# EAGLE design xlr_headphone_amp (EAGLE 6.3)
AUTOR: Max S.; VERSION: v3.0

## Sheet 1 of 2
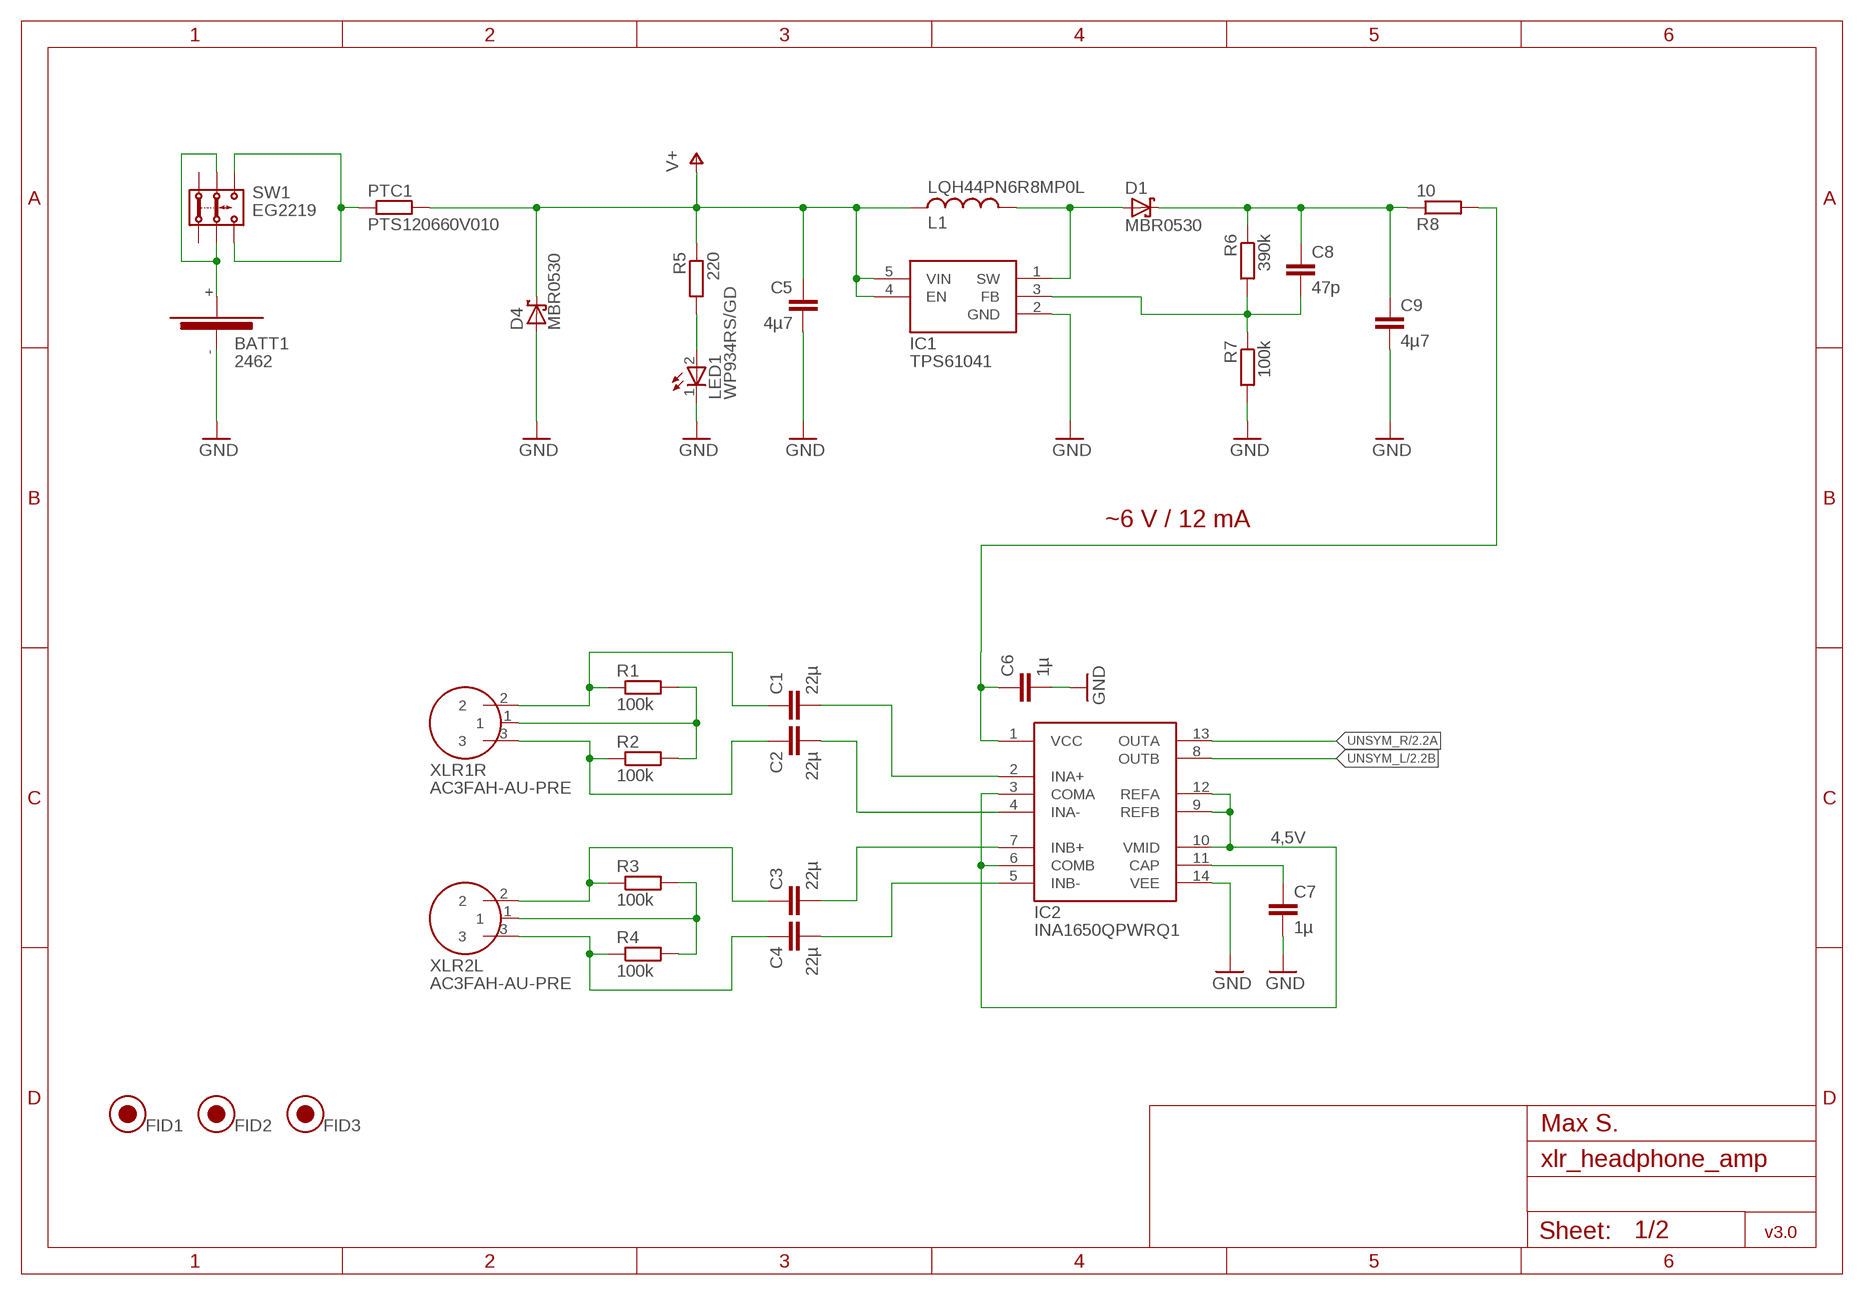
[diagram p0: schematic, sheet 1]

### Parts
BATT1  2462  BATT_HOLDERBATT  [2462]
C1  22µ  C_EU1206  [C1206]
C2  22µ  C_EU1206  [C1206]
C3  22µ  C_EU1206  [C1206]
C4  22µ  C_EU1206  [C1206]
C5  4µ7  C_EU1206  [C1206]
C6  1µ  C_EU1206  [C1206]
C7  1µ  C_EU1206  [C1206]
C8  47p  C_EU1206  [C1206]
C9  4µ7  C_EU1206  [C1206]
D1  MBR0530  SCHOTTKY-DIODESOD123  [SOD123]
D4  MBR0530  SCHOTTKY-DIODESOD123  [SOD123]
FID1  FIDICUAL  [FIDICUAL]
FID2  FIDICUAL  [FIDICUAL]
FID3  FIDICUAL  [FIDICUAL]
IC1  TPS61041  TPS6104X  [SOT23-5]
IC2  INA1650QPWRQ1  INA1650INA1650  [R-PDSO-G14]
L1  LQH44PN6R8MP0L  LL1515  [L1515(4040)]
LED1  WP934RS/GD  [WP934]
PTC1  PTS120660V010  R_EUR1206  [R1206]
R1  100k  R_EUR1206  [R1206]
R2  100k  R_EUR1206  [R1206]
R3  100k  R_EUR1206  [R1206]
R4  100k  R_EUR1206  [R1206]
R5  220  R_EUR1206  [R1206]
R6  390k  R_EUR1206  [R1206]
R7  100k  R_EUR1206  [R1206]
R8  10  R_EUR1206  [R1206]
SW1  EG2219  SW_2P2T  [EG2219]
XLR1R  AC3FAH-AU-PRE  XLR_CONNECTORFEMALE  [AC3FAH]
XLR2L  AC3FAH-AU-PRE  XLR_CONNECTORFEMALE  [AC3FAH]

### Nets
4,5V: IC2.3(COMA) IC2.6(COMB) IC2.9(REFB) IC2.10(VMID) IC2.12(REFA)
GND: BATT1.-(NEG) C5.2 C6.2 C7.2 C9.2 D4.A IC1.2(GND) IC2.14(VEE) LED1.1(C) R7.2 ; also sheet 2
N$1: R1.2 R2.2 XLR1R.1
N$2: C1.1 R1.1 XLR1R.2
N$3: C2.1 R2.1 XLR1R.3
N$4: C1.2 IC2.2(INA+)
N$5: C2.2 IC2.4(INA-)
N$6: R3.2 R4.2 XLR2L.1
N$7: C3.1 R3.1 XLR2L.2
N$8: C4.1 R4.1 XLR2L.3
N$9: C3.2 IC2.7(INB+)
N$10: C4.2 IC2.5(INB-)
N$11: C7.1 IC2.11(CAP)
N$25: LED1.2(A) R5.2
N$26: D1.A IC1.1(SW) L1.1
N$27: C8.2 IC1.3(FB) R6.2 R7.1
N$29: C8.1 C9.1 D1.C R6.1 R8.1
N$30: BATT1.+(POS) SW1.B1 SW1.B2
N$31: PTC1.1 SW1.C1 SW1.C2
N$32: C6.1 IC2.1(VCC) R8.2
UNSYM_L: IC2.8(OUTB) ; also sheet 2
UNSYM_R: IC2.13(OUTA) ; also sheet 2
V+: C5.1 D4.C IC1.4(EN) IC1.5(VIN) L1.2 PTC1.2 R5.1 ; also sheet 2
Unconnected: SW1.A1 SW1.A2

### Notes on the sheet
- ~6 V / 12 mA

## Sheet 2 of 2
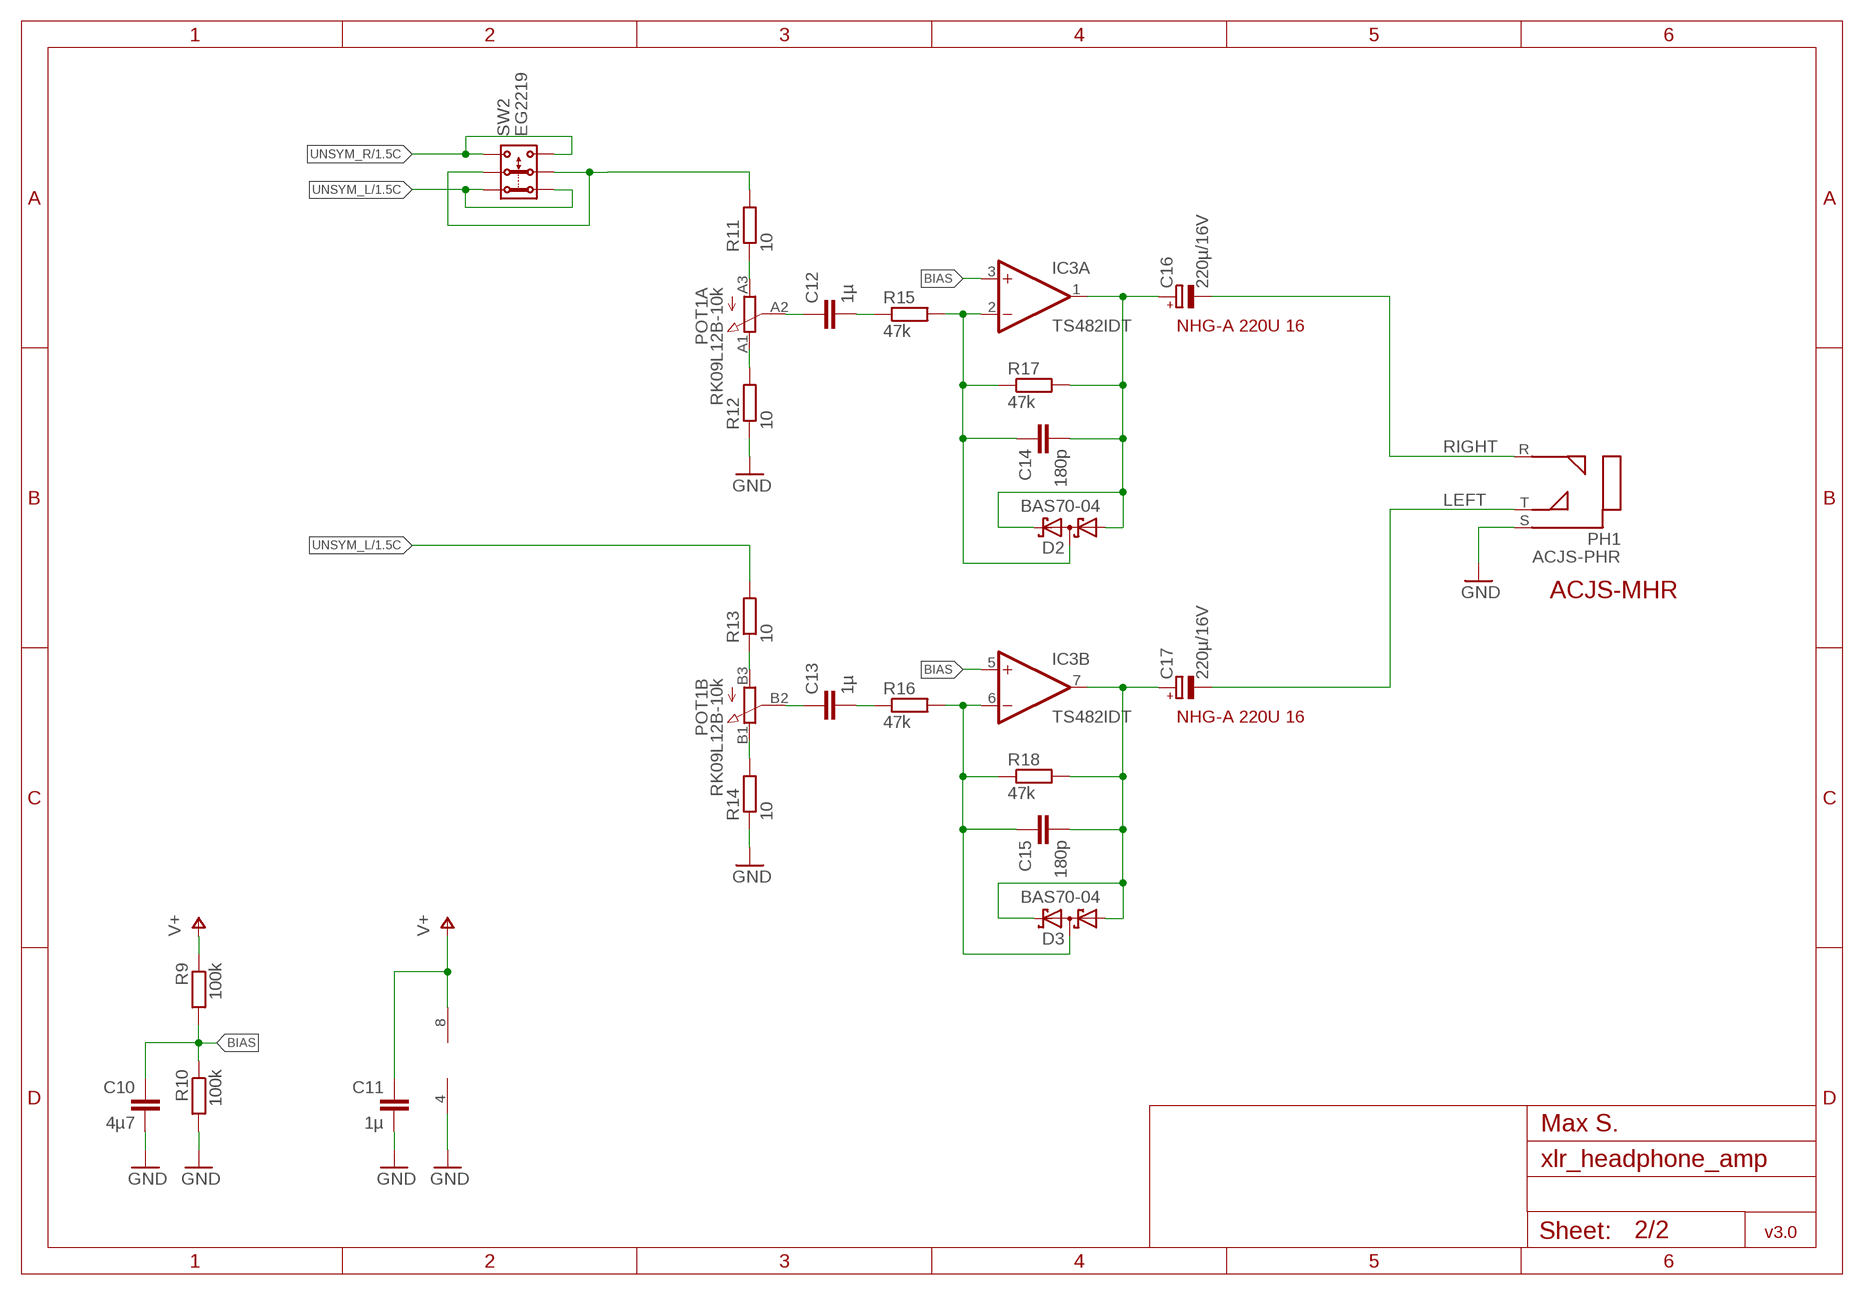
[diagram p1: schematic, sheet 2]

### Parts
C10  4µ7  C_EU1206  [C1206]
C11  1µ  C_EU1206  [C1206]
C12  1µ  C_EU1206  [C1206]
C13  1µ  C_EU1206  [C1206]
C14  180p  C_EU1206  [C1206]
C15  180p  C_EU1206  [C1206]
C16  220µ/16V  CPOL-EUE2.5-6  [E2,5-6]
C17  220µ/16V  CPOL-EUE2.5-6  [E2,5-6]
D2  BAS70-04  [SOT23]
D3  BAS70-04  [SOT23]
IC3  TS482IDT  LM358D  [SO08]
PH1  ACJS-PHR  1/4"_JACK-MH  [ACJS]
POT1  RK09L12B-10k  AUDIO_POTRK09L12  [RK09L12]
R9  100k  R_EUR1206  [R1206]
R10  100k  R_EUR1206  [R1206]
R11  10  R_EUR1206  [R1206]
R12  10  R_EUR1206  [R1206]
R13  10  R_EUR1206  [R1206]
R14  10  R_EUR1206  [R1206]
R15  47k  R_EUR1206  [R1206]
R16  47k  R_EUR1206  [R1206]
R17  47k  R_EUR1206  [R1206]
R18  47k  R_EUR1206  [R1206]
SW2  EG2219  SW_2P2T  [EG2219]

### Nets
BIAS: C10.1 IC3.3(A:+IN) IC3.5(B:+IN) R9.2 R10.1
GND: C10.2 C11.2 IC3.4(P:V-) PH1.S R10.2 R12.1 R14.1 ; also sheet 1
LEFT: C17.- PH1.T
N$12: POT1.B1 R14.2
N$13: POT1.B3 R13.1
N$14: C14.1 D2.3(C1A2) IC3.2(A:-IN) R15.2 R17.1
N$15: R11.2 SW2.B1 SW2.B2
N$16: C13.1 POT1.B2
N$17: POT1.A1 R12.2
N$18: C12.2 R15.1
N$19: C12.1 POT1.A2
N$20: C15.1 D3.3(C1A2) IC3.6(B:-IN) R16.2 R18.1
N$21: C15.2 C17.+ D3.1(A1) D3.2(C2) IC3.7(B:OUT) R18.2
N$22: POT1.A3 R11.1
N$23: C13.2 R16.1
N$24: C14.2 C16.+ D2.1(A1) D2.2(C2) IC3.1(A:OUT) R17.2
RIGHT: C16.- PH1.R
UNSYM_L: R13.2 SW2.A1 SW2.A2 ; also sheet 1
UNSYM_R: SW2.C1 SW2.C2 ; also sheet 1
V+: C11.1 IC3.8(P:V+) R9.1 ; also sheet 1

### Notes on the sheet
- NHG-A 220U 16
- ACJS-MHR
- NHG-A 220U 16

## Library data of the parts
BATT1 = xlr_headphoneamp:BATT_HOLDER
C1-C15 = NWA_Projekt:C_EU
C16 C17 = rcl:CPOL-EU: POLARIZED CAPACITOR, European symbol
D1 D4 = diode:SCHOTTKY-DIODE: Schottky Diode
D2 D3 = diode:BAS70-04: Silicon Schottky Diodes General-purpose diode for high-speed switching
FID1-FID3 = xlr_headphoneamp:FIDICUAL
IC1 = xlr_headphoneamp:TPS6104X
IC2 = xlr_headphoneamp:INA1650
IC3 = linear:LM358: OP AMP also LM158; LM258; LM2904 Source: http://cache.national.com/ds/LM/LM158.pdf
L1 = xlr_headphoneamp:L
LED1 = xlr_headphoneamp:WP934
PH1 = xlr_headphoneamp:1/4"_JACK
POT1 = xlr_headphoneamp:AUDIO_POT
PTC1 R1-R18 = NWA_Projekt:R_EU
SW1 SW2 = xlr_headphoneamp:SW_2P2T
XLR1R XLR2L = xlr_headphoneamp:XLR_CONNECTOR

## Board
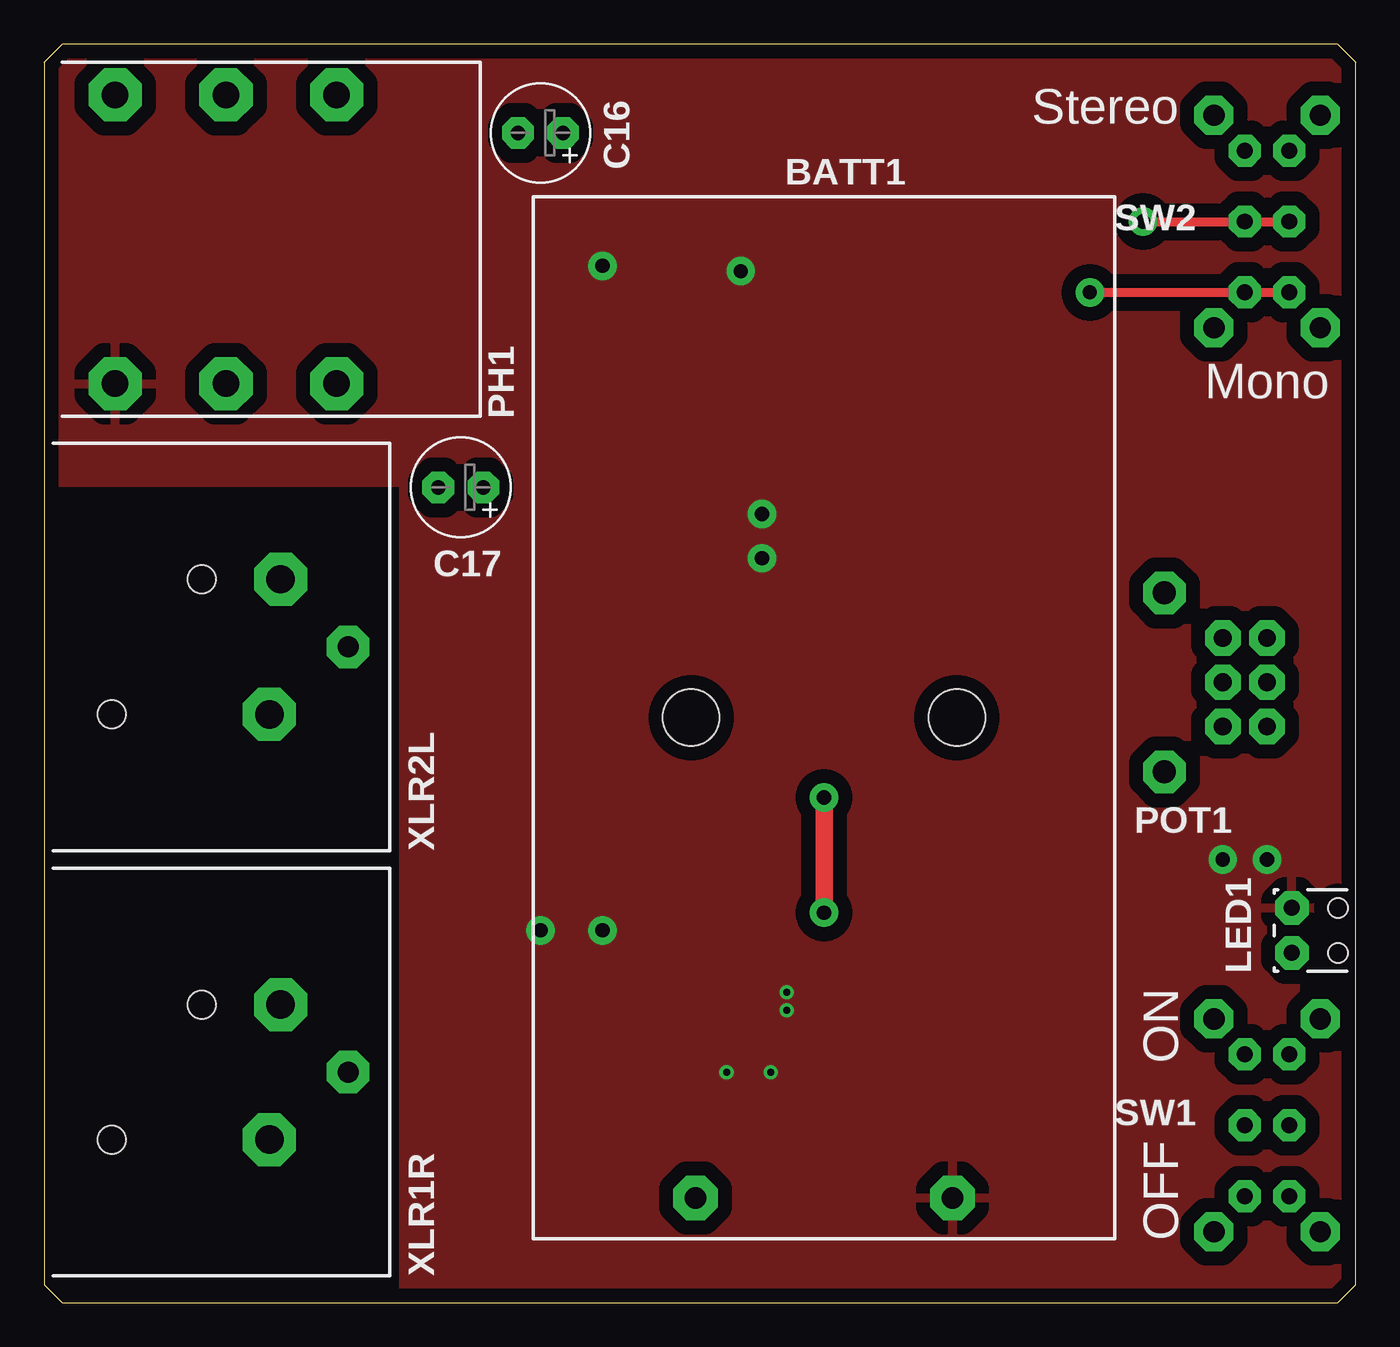
[diagram p2: board, top side]
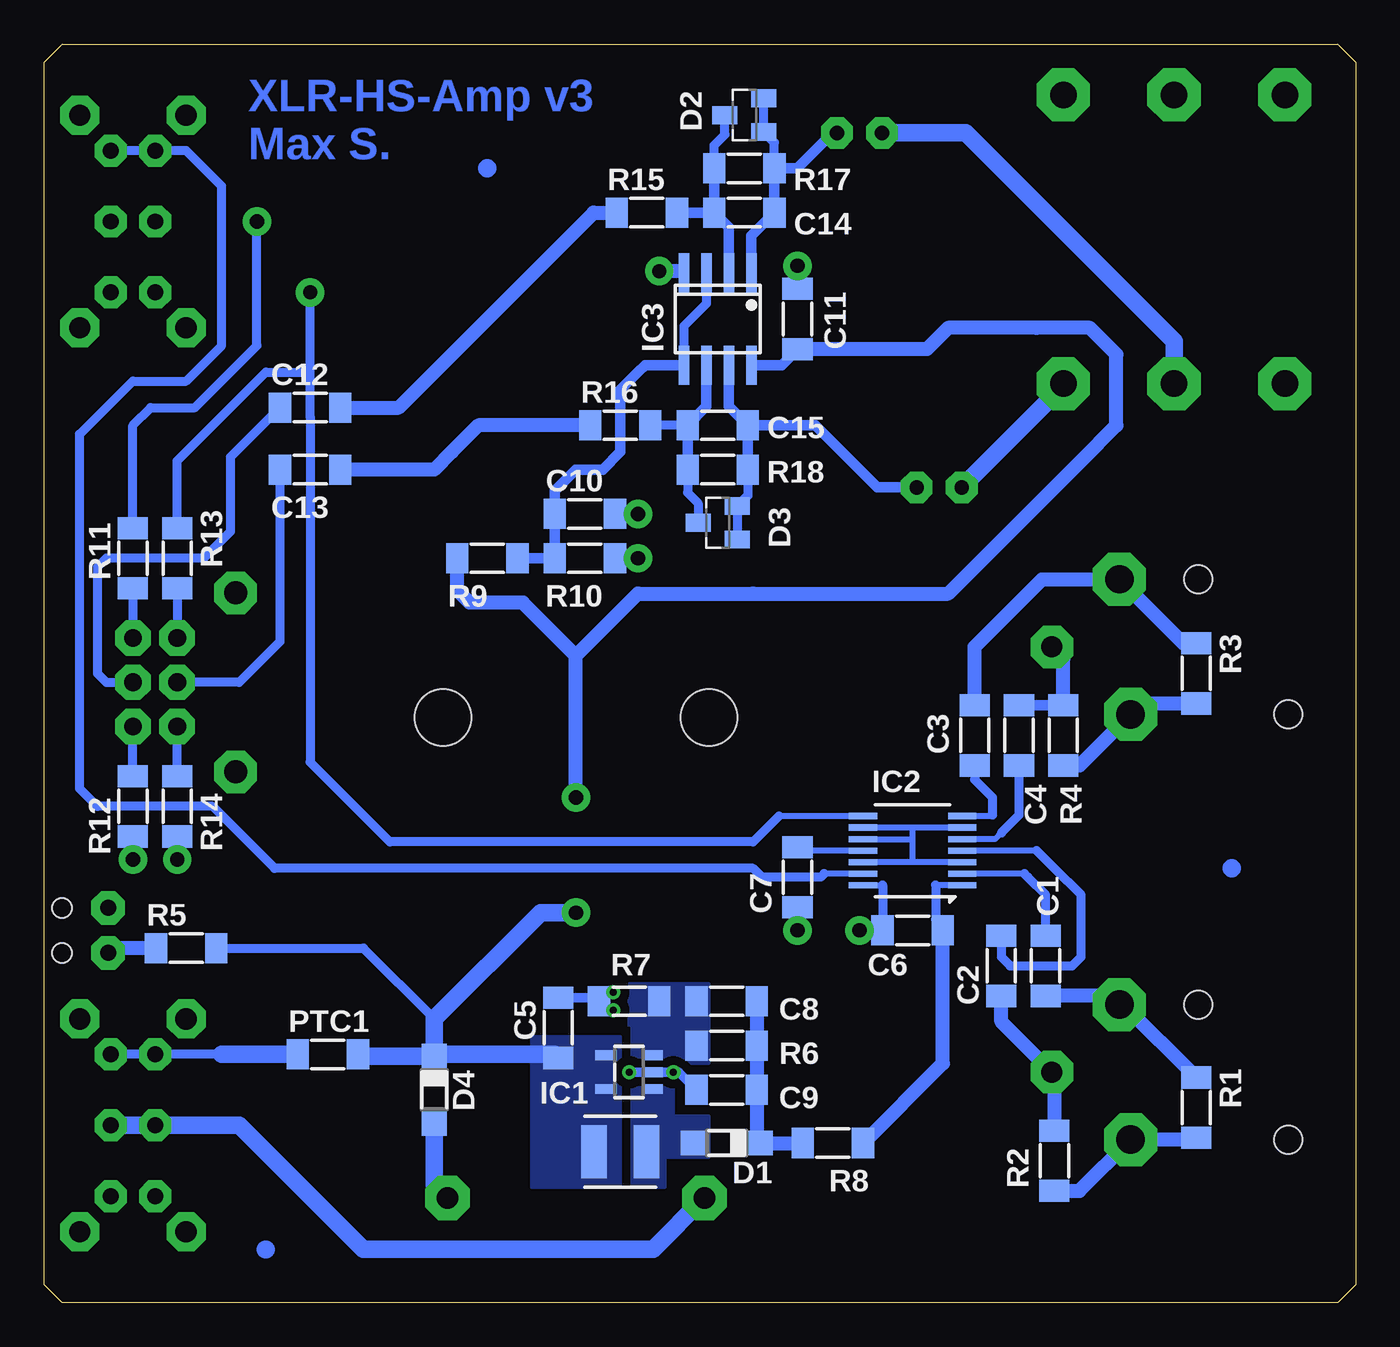
[diagram p3: board, bottom side, seen from below]

Size 74 x 71 mm. Coordinates in mm from the lower left corner, seen from the top.
Outline: 1,0 73,0 74,1 74,70 73,71 1,71 0,70 0,1 1,0
Copper layers (1*16): Top 0.018mm / dielectric 0.138mm / Bottom 0.018mm
Design rules "Aisler_4layer_DRC *": minimum track width 6mil, minimum drill 0.2mm, track to track 6mil, track to pad 6mil, pad to pad 6mil, via to via 6mil, smd to smd 0mil, copper to edge 0.4mm, drill to drill 10mil, minimum pad ring 10mil, minimum via ring 0.15mm, stop-mask expansion 2mil, vias tented up to drill 100mil, thermal gap 0.8mm
bRestrict: area 30.5,27 to 42.5,39; area 45.5,27 to 57.5,39

### Footprints (pad centres in the part's own frame; a part is rotated, then mirrored left to right if it is on the bottom)
2462 = drill 1.2 pad 2.5 octagon: + 27.1,-7.25; - 27.1,7.25 | hole 3.2: 0,-7.5; 0,7.5
C1206 = smd 1.25 x 1.7: 1 -1.7,0; 2 1.7,0
E2,5-6 = drill 0.813 pad 1.778 octagon: + -1.27,0; - 1.27,0
SOD123 = smd 1.4 x 1.4: A 1.9,0; C -1.9,0
SOT23 = smd 1 x 1.4: 1 -0.95,-1.1; 2 0.95,-1.1; 3 0,1.1
SOT23-5 = smd 0.55 x 1.2: 1 -0.95,-1.3; 2 0,-1.3; 3 0.95,-1.3; 4 0.95,1.3; 5 -0.95,1.3
R-PDSO-G14 = smd 0.35 x 1.6: 1 -1.95,-2.8; 2 -1.3,-2.8; 3 -0.65,-2.8; 4 0,-2.8; 5 0.65,-2.8; 6 1.3,-2.8; 7 1.95,-2.8; 8 1.95,2.8; 9 1.3,2.8; 10 0.65,2.8; 11 0,2.8; 12 -0.65,2.8; 13 -1.3,2.8; 14 -1.95,2.8
SO08 = smd 0.6 x 2.2: 1 -1.905,-2.6; 2 -0.635,-2.6; 3 0.635,-2.6; 4 1.905,-2.6; 5 1.905,2.6; 6 0.635,2.6; 7 -0.635,2.6; 8 -1.905,2.6
L1515(4040) = smd 1.45 x 3: 1 -1.475,0; 2 1.475,0
WP934 = drill 0.9 pad 1.9 octagon: 1 3.6,-1.27; 2 3.6,1.27 | hole 1.1: 1,-1.27; 1,1.27
ACJS = drill 1.5 pad 3 octagon: R -8.15,-10.25; RN 8.15,-10.25; S -8.15,-4; SN 8.15,-4; T -8.15,-16.5; TN 8.15,-16.5
RK09L12 = drill 1 pad 2 octagon: A1 -5,-2.5; A2 -5,0; A3 -5,2.5; B1 -7.5,-2.5; B2 -7.5,0; B3 -7.5,2.5 | drill 1.3 pad 2.4 octagon: M1 -10.8,5.05; M2 -10.8,-5.05
R1206 = smd 1.25 x 1.7: 1 -1.7,0; 2 1.7,0
EG2219 = drill 0.9 pad 1.8 octagon: A1 -4,1.25; A2 -4,-1.25; B1 0,1.25; B2 0,-1.25; C1 4,1.25; C2 4,-1.25 | drill 1.2 pad 2.2 octagon: X1 -6,-3; X2 -6,3; X3 6,3; X4 6,-3
AC3FAH = drill 1.6 pad 3 octagon: 1 -3.81,-12.7; 2 3.81,-13.335 | drill 1.2 pad 2.4 octagon: 3 0,-17.145 | hole 1.6: -3.81,-3.81; 3.81,-8.89

### Placement (x,y rotation side)
BATT1  44,33 270 top
C1  17.5,19 90 bottom
C2  20,19 90 bottom
C3  21.5,32 270 bottom
C4  19,32 270 bottom
C5  45,15.5 90 bottom
C6  25,21 180 bottom
C7  31.5,24 270 bottom
C8  35.5,17 180 bottom
C9  35.5,12 180 bottom
C10  43.5,44.5 0 bottom
C11  31.5,55.5 90 bottom
C12  59,50.5 0 bottom
C13  59,47 0 bottom
C14  34.5,61.5 0 bottom
C15  36,49.5 0 bottom
C16  28,66 180 top
C17  23.5,46 180 top
D1  35.5,9 180 bottom
D2  34.5,67 90 bottom
D3  36,44 90 bottom
D4  52,12 270 bottom
FID1  7,24.5 0 bottom
FID2  61.5,3 0 bottom
FID3  49,64 0 bottom
IC1  41,13 90 bottom
IC2  25,25.5 90 bottom
IC3  36,55.5 180 bottom
L1  41.5,8.5 180 bottom
LED1  74,21 180 top
PH1  0,60 90 top
POT1  74,35 0 top
PTC1  58,14 0 bottom
R1  9,11 270 bottom
R2  17,8 270 bottom
R3  9,35.5 270 bottom
R4  16.5,32 270 bottom
R5  66,20 180 bottom
R6  35.5,14.5 180 bottom
R7  41,17 180 bottom
R8  29.5,9 0 bottom
R9  49,42 0 bottom
R10  43.5,42 0 bottom
R11  69,42 90 bottom
R12  69,28 90 bottom
R13  66.5,42 90 bottom
R14  66.5,28 90 bottom
R15  40,61.5 0 bottom
R16  41.5,49.5 0 bottom
R17  34.5,64 0 bottom
R18  36,47 0 bottom
SW1  69,10 90 top
SW2  69,61 90 top
XLR1R  0,13 90 top
XLR2L  0,37 90 top

### Tracks (layer width: path | path; a pad name or v marks a point on that pad's centre or on a via)
4,5V
  Bottom 0.35: IC2.6 25,26.8 | 25,26.8 IC2.9 | IC2.3 24.98,24.85 | 24.98,24.85 IC2.12 | 24.98,24.85 25,24.87 25,26.5 | 25,26.5 25,26.8 | IC2.10 25,26.15 25,26.5
BIAS
  Bottom 0.35: 47,42 R9.2
  Bottom 0.5: IC3.3 36.63,56.37 37.5,55.5 37.91,55.09 IC3.5
  Bottom 0.6: 47,42 R10.1 C10.1 45.2,45.8 44,47 42.5,47 41.5,48 41.5,51.5 40.5,52.5 40.1,52.9 IC3.5
GND  (via drill 0.4 pad 0.8, 0.8 pad 1.6)
  Bottom 0.35: IC2.14 26.7,23.55 | IC3.4 38.01,58.2
  Bottom 0.5: 26.7,23.55 C6.2
  Bottom 0.55: C9.2 38.2,13 IC1.2 v41,13 | R7.2 42.7,17.2 | 42.7,17.2 C5.2 | 42.7,17.2 42.5,17.4 | C11.2 v31.5,58.5
  Bottom 0.6: R14.1 66.5,26.1 | R12.1 69,26 | 42.5,17.4 42.5,17.5 v41.9,17.5 | R7.2 42.7,16.5 v41.9,16.5
  Bottom 0.8: 38.01,58.2 v39.3,58.2
  Bottom 1: C10.2 v40.5,44.5 | R10.2 v40.5,42 | C6.2 v28,21 | C7.2 v31.5,21 | 66.5,26.1 v66.5,25 | 69,26 v69,25 | BATT1.- 52,6.65 D4.A
  other vias: 38.5,13
  pour Top (isolate 0.8): 0,71 74,71 74,0 0,0
LEFT
  Bottom 1: PH1.T 16.5,51.73 C17.-
N$1
  Bottom 0.35: R1.2 9.11,9.19
  Bottom 0.8: 9.11,9.19 XLR1R.1 15.59,6.3 R2.2
N$2
  Bottom 0.6: XLR1R.2 13.11,16.81
  Bottom 0.8: 13.11,16.81 R1.1 | XLR1R.2 13.82,17.3 C1.1
N$3
  Bottom 0.35: XLR1R.3 17,12.86
  Bottom 0.8: XLR1R.3 20,15.86 C2.1 | 17,12.86 R2.1
N$4
  Bottom 0.35: 18.7,24.2 IC2.2
  Bottom 0.5: C1.2 17.5,23 18.5,24 18.7,24.2
N$5
  Bottom 0.35: 18,25.5 IC2.4
  Bottom 0.5: C2.2 20,19.5 19.5,19 16,19 15.5,19.5 15.5,23 17,24.5 18,25.5
N$6
  Bottom 0.6: 15.59,30.3 R4.2
  Bottom 0.8: R3.2 12.09,33.8 XLR2L.1 15.59,30.3
N$7
  Bottom 0.35: R3.1 9.72,37.2
  Bottom 0.8: 9.72,37.2 XLR2L.2 17.69,40.81 18,40.5 21.5,37 C3.1
N$8
  Bottom 0.6: R4.1 C4.1
  Bottom 0.8: R4.1 16.5,36.35 XLR2L.3
N$9
  Bottom 0.35: 20.5,27.5 20.55,27.45 IC2.7
  Bottom 0.5: C3.2 21.5,29.5 21,29 20.5,28.5 20.5,28 20.5,27.5
N$10
  Bottom 0.35: 20,26.5 20.35,26.15 IC2.5
  Bottom 0.5: C4.2 19,27.5 20,26.5
N$11
  Bottom 0.35: IC2.11 31.5,25.5 C7.1
N$12
  Bottom 0.5: R14.2 POT1.B1
N$13
  Bottom 0.5: R13.1 POT1.B3
N$14
  Bottom 0.5: R17.1 36.2,65.3 36,65.5 35.6,65.9 D2.3
  Bottom 0.6: IC3.2 35.37,60.66 C14.1 | C14.1 R15.2 | C14.1 R17.1
N$15  (via drill 0.8 pad 1.6)
  Top 0.5: v62,61 SW2.B1 SW2.B2
  Bottom 0.5: R11.2 69,49.5 68,50.5 65.5,50.5 62,54 v62,61
N$16
  Bottom 0.5: C13.1 60.7,37.3 63,35 POT1.B2
N$17
  Bottom 0.5: R12.2 POT1.A1
N$18
  Bottom 0.8: C12.2 54,50.5 47,57.5 43,61.5 R15.1
N$19
  Bottom 0.5: C12.1 63.5,47.7 63.5,44 63.5,43.5 65,42 70.5,42 71,41.5 71,35.5 70.5,35 POT1.A2
N$20
  Bottom 0.5: C15.1 R16.2 | R18.1 37.7,45.7 37.5,45.5 37.1,45.1 D3.3
  Bottom 0.6: IC3.6 36.63,50.56 C15.1 R18.1
N$21
  Bottom 0.5: R18.2 34.3,45.55 D3.2 D3.1
  Bottom 0.6: IC3.7 35.37,50.56 C15.2 | C15.2 R18.2 | C17.+ 27,46 30.5,49.5 C15.2
N$22
  Bottom 0.5: R11.1 POT1.A3
N$23
  Bottom 0.8: R16.1 49.5,49.5 51,48 52,47 C13.2
N$24
  Bottom 0.5: R17.2 32.8,65.45 D2.1 D2.2
  Bottom 0.6: IC3.1 34.09,60.2 C14.2 R17.2 31.5,64 29.5,66 C16.+
N$25
  Bottom 0.8: R5.2 70.13,20 LED1.2
N$26
  pour Bottom (isolate 0.5, rank 2, no thermals): 41,12.5 38.5,12.5 38.5,10.5 36.5,10.5 36.5,8.2 39,8.2 39,6.5 41,6.5
N$27
  pour Bottom (isolate 0.5, rank 3, no thermals): 36.5,13.5 41,13.5 41,18 36.5,18
N$28
  cutout Top: 0,0 20,0 20,46 0,46
N$29
  Bottom 0.5: 33.8,9.2 D1.C
  Bottom 0.8: C8.1 R6.1 C9.1 33.8,9.2 | D1.C R8.1
N$30
  Bottom 1: BATT1.+ 39.65,3 56,3 63,10 SW1.B1 SW1.B2
N$31
  Bottom 0.5: 64,14 SW1.C1 SW1.C2
  Bottom 1: PTC1.1 64,14
N$32
  Bottom 0.35: IC2.1 23.7,23.55 | 23.7,21.6 23.3,21.6 C6.1
  Bottom 0.5: 23.7,23.55 23.7,21.6
  Bottom 0.8: R8.2 23.3,13.5 C6.1
RIGHT
  Bottom 1: PH1.R 10.25,54.25 19.5,63.5 22,66 C16.-
UNSYM_L  (via drill 0.8 pad 1.6)
  Top 0.5: v59,57 SW2.A1 SW2.A2
  Bottom 0.35: IC2.8 32.55,27.45
  Bottom 0.5: 32.55,27.45 34,26 54.5,26 59,30.5 59,50 59,52.5 | 59,52.5 v59,57 | R13.2 66.5,47.5 61.5,52.5 59,52.5
UNSYM_R
  Bottom 0.35: IC2.13 30,24.2
  Bottom 0.5: 30,24.2 30.2,24 32.5,24 33.5,24 34,24.5 61,24.5 64.5,28 71,28 72,29 72,42.5 72,49 69,52 66,52 64,54 64,63 66,65 SW2.C1 SW2.C2
V+  (via drill 0.8 pad 1.6)
  Top 1: v44,22 v44,28.5
  Bottom 0.5: R5.1 56,20 52,16 52,14 D4.C
  Bottom 0.55: 45.2,14 C5.1
  Bottom 0.6: C11.1 32.4,52.9 IC3.8
  Bottom 0.8: v44,28.5 44,36.5 | 44,36.5 47,39.5 50,39.5 50.7,40.2 R9.1 | 44,36.5 40.5,40 34,40 23,40 15.5,47.5 13.5,49.5 13.5,53.5 15,55 18,55 23,55 24,54 24.2,53.8 C11.1
  Bottom 1: 45.2,14 52,14 | 52,14 D4.C 56.3,13.9 PTC1.2 | v44,22 46,22 52,16 52,14
  pour Bottom (isolate 0.5, no thermals): 41.5,15 46.5,15 46.5,6.5 41.5,6.5

### Text on the board
Bottom: XLR-HS-Amp v3 / Max S.
tPlace: Stereo | Mono | ON | OFF